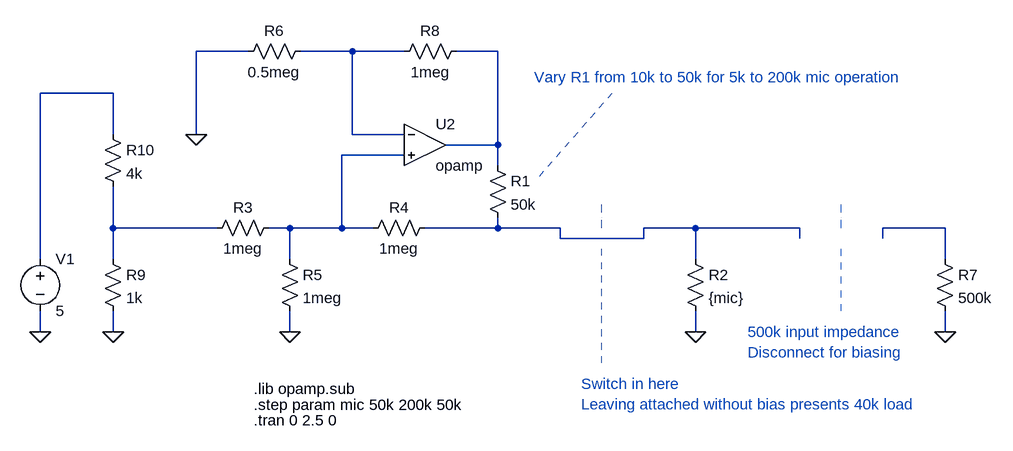
[diagram p0: schematic mic bias.asc]
mic bias.asc, the LTspice schematic file:
Version 4
SHEET 1 1916 680
WIRE 96 -48 16 -48
WIRE 256 -48 176 -48
WIRE 336 -48 256 -48
WIRE 480 -48 416 -48
WIRE -112 16 -224 16
WIRE -112 80 -112 16
WIRE 16 80 16 -48
WIRE 256 80 256 -48
WIRE 336 80 256 80
WIRE 480 96 480 -48
WIRE 480 96 400 96
WIRE 336 112 240 112
WIRE 480 128 480 96
WIRE -112 224 -112 160
WIRE 48 224 -112 224
WIRE 160 224 128 224
WIRE 240 224 240 112
WIRE 240 224 160 224
WIRE 288 224 240 224
WIRE 480 224 480 208
WIRE 480 224 368 224
WIRE 576 224 480 224
WIRE 784 224 704 224
WIRE 944 224 784 224
WIRE 1168 224 1072 224
WIRE 576 240 576 224
WIRE 704 240 704 224
WIRE 704 240 576 240
WIRE 944 240 944 224
WIRE 1072 240 1072 224
WIRE -224 272 -224 16
WIRE -112 272 -112 224
WIRE 160 272 160 224
WIRE 784 272 784 224
WIRE 1168 272 1168 224
WIRE -224 384 -224 352
WIRE -112 384 -112 352
WIRE 160 384 160 352
WIRE 784 384 784 352
WIRE 1168 384 1168 352
FLAG -224 384 0
FLAG 784 384 0
FLAG 160 384 0
FLAG 16 80 0
FLAG 1168 384 0
FLAG -112 384 0
SYMBOL voltage -224 256 R0
WINDOW 123 0 0 Left 2
WINDOW 39 0 0 Left 2
SYMATTR InstName V1
SYMATTR Value 5
SYMBOL res 464 112 R0
SYMATTR InstName R1
SYMATTR Value 50k
SYMBOL res 768 256 R0
SYMATTR InstName R2
SYMATTR Value {mic}
SYMBOL res 32 240 R270
WINDOW 0 32 56 VTop 2
WINDOW 3 0 56 VBottom 2
SYMATTR InstName R3
SYMATTR Value 1meg
SYMBOL res 272 240 R270
WINDOW 0 32 56 VTop 2
WINDOW 3 0 56 VBottom 2
SYMATTR InstName R4
SYMATTR Value 1meg
SYMBOL res 144 256 R0
SYMATTR InstName R5
SYMATTR Value 1meg
SYMBOL res 80 -32 R270
WINDOW 0 32 56 VTop 2
WINDOW 3 0 56 VBottom 2
SYMATTR InstName R6
SYMATTR Value 0.5meg
SYMBOL res 320 -32 R270
WINDOW 0 32 56 VTop 2
WINDOW 3 0 56 VBottom 2
SYMATTR InstName R8
SYMATTR Value 1meg
SYMBOL Opamps\\opamp 368 32 R0
SYMATTR InstName U2
SYMBOL res 1152 256 R0
SYMATTR InstName R7
SYMATTR Value 500k
SYMBOL res -128 256 R0
SYMATTR InstName R9
SYMATTR Value 1k
SYMBOL res -128 64 R0
SYMATTR InstName R10
SYMATTR Value 4k
TEXT 104 472 Left 2 !.lib opamp.sub
TEXT 104 520 Left 2 !.tran 0 2.5 0
TEXT 104 496 Left 2 !.step param mic 50k 200k 50k
TEXT 608 464 Left 2 ;Switch in here\nLeaving attached without bias presents 40k load
TEXT 864 384 Left 2 ;500k input impedance\nDisconnect for biasing
TEXT 536 -8 Left 2 ;Vary R1 from 10k to 50k for 5k to 200k mic operation
LINE Normal 640 224 640 176 2
LINE Normal 640 208 640 208 2
LINE Normal 544 144 656 16 2
LINE Normal 1008 224 1008 176 2
LINE Normal 1008 208 1008 208 2
LINE Normal 1008 352 1008 256 2
LINE Normal 640 432 640 256 2

The netlist it stands for:
* mic bias.asc
V1 N003 0 5
R1 N002 N006 50k
R2 N006 0 {mic}
R3 N005 N004 1meg
R4 N004 N006 1meg
R5 N004 0 1meg
R6 0 N001 0.5meg
R8 N001 N002 1meg
XU2 N001 N004 N002 opamp Aol=100K GBW=10Meg  ; pins invin noninvin out
R7 N007 0 500k
R9 N005 0 1k
R10 N003 N005 4k
.lib opamp.sub
.tran 0 2.5 0
.step param mic 50k 200k 50k
* Switch in here
* Leaving attached without bias presents 40k load
* 500k input impedance
* Disconnect for biasing
* Vary R1 from 10k to 50k for 5k to 200k mic operation
.backanno
.end